# EAGLE design Searchlight Controller V3_4 (EAGLE 8.0.2)
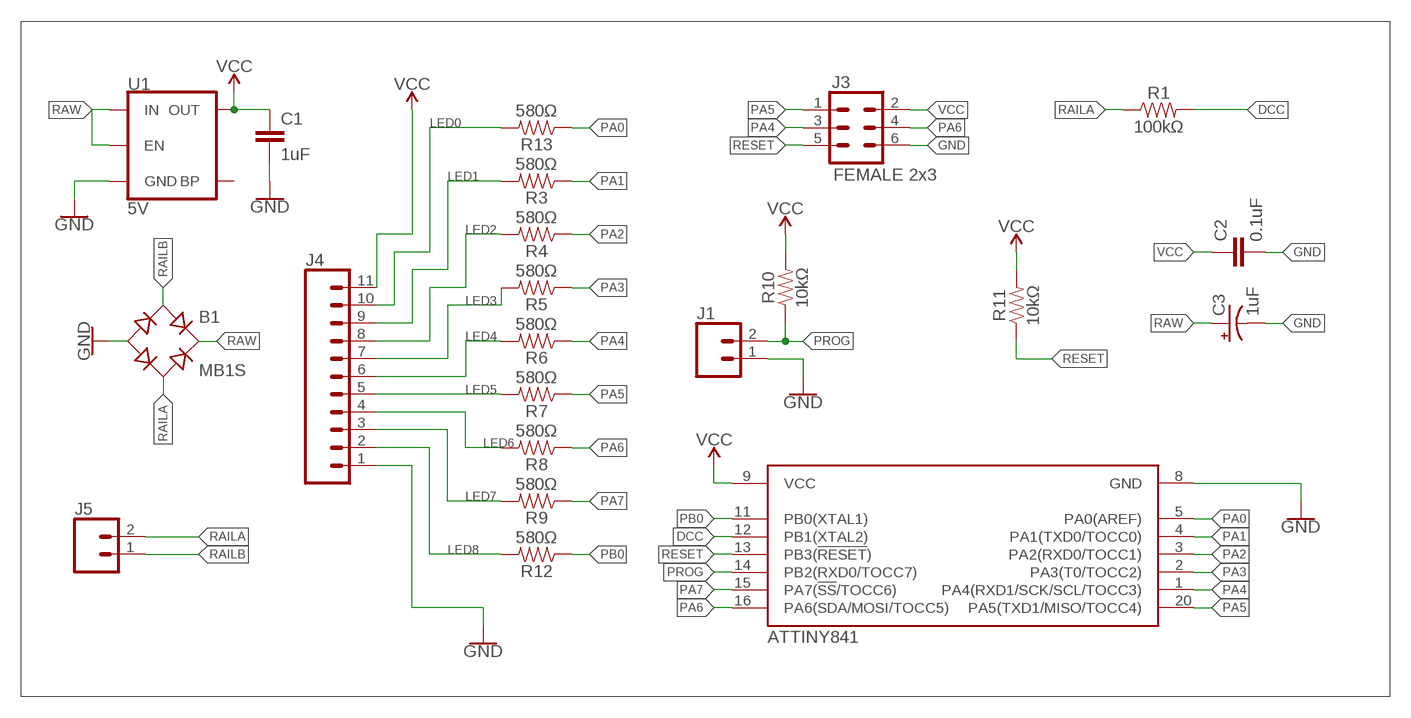
[diagram p0: schematic, sheet 1]

## Parts
B1  MB1S  [SOIC-4]
C1  1uF  0.1UF-0603-25V-5%  [0603]
C2  0.1uF  0.1UF-0603-25V-5%  [0603]
C3  1uF  10UF-POLAR-EIA3216-16V-10%(TANT)  [EIA3216]
J1  CONN_02LOCK  [1X02_LOCK]
J3  FEMALE 2x3  CONN_03X2FEMALE  [2X3]
J4  CONN_11LONGPADS  [1X11_LONGPADS]
J5  CONN_02  [1X02]
R1  100kΩ  RESISTOR0603  [0603]
R3  580Ω  RESISTOR0603  [0603]
R4  580Ω  RESISTOR0603  [0603]
R5  580Ω  RESISTOR0603  [0603]
R6  580Ω  RESISTOR0603  [0603]
R7  580Ω  RESISTOR0603  [0603]
R8  580Ω  RESISTOR0603  [0603]
R9  580Ω  RESISTOR0603  [0603]
R10  10kΩ  RESISTOR0603  [0603]
R11  10kΩ  RESISTOR0603  [0603]
R12  580Ω  RESISTOR0603  [0603]
R13  580Ω  RESISTOR0603  [0603]
U1  5V  V_REG_MIC52055V  [SOT23-5]
U$1  ATTINY841-MMH  [QFN-20-4X4MM]

## Nets
DCC: R1.2 U$1.12(PB1(XTAL2))
GND: B1.- C1.2 C2.2 C3.- J1.1 J3.6 J4.1 U1.2(GND) U$1.8(GND)
LED0: J4.10 R13.2
LED1: J4.9 R3.2
LED2: J4.8 R4.2
LED3: J4.7 R5.2
LED4: J4.6 R6.2
LED5: J4.5 R7.2
LED6: J4.4 R8.2
LED7: J4.3 R9.2
LED8: J4.2 R12.2
PA0: R13.1 U$1.5(PA0(AREF))
PA1: R3.1 U$1.4(PA1(TXD0/TOCC0))
PA2: R4.1 U$1.3(PA2(RXD0/TOCC1))
PA3: R5.1 U$1.2(PA3(T0/TOCC2))
PA4: J3.3 R6.1 U$1.1(PA4(RXD1/SCK/SCL/TOCC3))
PA5: J3.1 R7.1 U$1.20(PA5(TXD1/MISO/TOCC4))
PA6: J3.4 R8.1 U$1.16(PA6(SDA/MOSI/TOCC5))
PA7: R9.1 U$1.15(PA7(!SS!/TOCC6))
PB0: R12.1 U$1.11(PB0(XTAL1))
PROG: J1.2 R10.1 U$1.14(PB2(RXD0/TOCC7))
RAILA: B1.~2(AC2) J5.2 R1.1
RAILB: B1.~1(AC1) J5.1
RAW: B1.+ C3.+ U1.1(IN) U1.3(EN)
RESET: J3.5 R11.1 U$1.13(PB3(!RESET!))
VCC: C1.1 C2.1 J3.2 J4.11 R10.2 R11.2 U1.5(OUT) U$1.9(VCC)
Unconnected: U1.4(BP)

## Library data of the parts
B1 = rectifier:MB*S: Bridge Rectifier Source: http://www.fairchildsemi.com/ds/MB/MB6S.pdf
C1 = SparkFun-Capacitors:0.1UF: 0.1µF ceramic capacitors A capacitor is a passive two-terminal electrical component used to store electrical energy temporarily in an electric field.; PROD_ID: CAP-08604; VALUE: 0.1uF
C2 = SparkFun-Capacitors:0.1UF: 0.1µF ceramic capacitors A capacitor is a passive two-terminal electrical component used to store electrical energy temporarily in an electric field.; PROD_ID: CAP-08604
C3 = SparkFun-Capacitors:10UF-POLAR: 10.0µF polarized capacitors A capacitor is a passive two-terminal electrical component used to store electrical energy temporarily in an electric field.; PROD_ID: CAP-00811; VALUE: 10uF
J1 J5 = SparkFun-Connectors:CONN_02: Multi connection point. Often used as Generic Header-pin footprint for 0.1 inch spaced/style header connections On any of the 0.1 inch spaced packages, you can populate with these: Break Away Headers - Straight <https://www.sparkfun.com/products/116> (PRT-00116) Break Away Male Headers - Right Angle <https://www.sparkfun.com/products/553> (PRT-00553) Female Headers <https://www.sparkfun.com/products/115> (PRT-00115) Break Away Headers - Machine Pin <https://www.sparkfun.com/products/117> (PRT-00117) Break Away Female Headers - Swiss Machine Pin <https://www.sparkfun.com/products/743> (PRT-00743) For SCREWTERMINALS and SPRING TERMINALS visit here: Screw Terimnals on SparkFun.com <https://www.sparkfun.com/search/results?term=Screw+Terminals> (5mm/3.5mm/2.54mm spacing) This device is also useful as a general connection point to wire up your design to another part of your project. Our various solder wires solder well into these plated through hole pads. Hook-Up Wire - Assortment (Stranded, 22 AWG) <https://www.sparkfun.com/products/11375> (PRT-11375) Hook-Up Wire - Assortment (Solid Core, 22 AWG) <https://www.sparkfun.com/products/11367> (PRT-11367) View the entire wire category on our website here <https://www.sparkfun.com/categories/141> Special notes: Molex polarized connector foot print use with: PRT-08233 with associated crimp pins and housings. 2.54_SCREWTERM for use with PRT-10571. 3.5mm Screw Terminal footprints for PRT-08084 5mm Screw Terminal footprints for use with PRT-08432
J3 = SparkFun-Connectors:CONN_03X2: Multi connection point. Often used as Generic Header-pin footprint for 0.1 inch spaced/style header connections You can populate with any combo of single row headers, but if you'd like an exact match, check these: Header - 2x3 (Male, 0.1") <https://www.sparkfun.com/products/12807> (PRT-12807) Header - 2x3 (Female, 0.1") <https://www.sparkfun.com/products/13010> (PRT-13010) 2x3 Pin Shrouded Header <https://www.sparkfun.com/products/10877> (PRT-10877) On any of the 0.1 inch spaced packages, you can populate with these: Break Away Headers - Straight <https://www.sparkfun.com/products/116> (PRT-00116) Break Away Male Headers - Right Angle <https://www.sparkfun.com/products/553> (PRT-00553) Female Headers <https://www.sparkfun.com/products/115> (PRT-00115) Break Away Headers - Machine Pin <https://www.sparkfun.com/products/117> (PRT-00117) Break Away Female Headers - Swiss Machine Pin <https://www.sparkfun.com/products/743> (PRT-00743) Special note: the shrouded connector mates well with our 3x2 ribbon cables: Ribbon Crimp Connector - 6-pin (2x3, Female) <https://www.sparkfun.com/products/10651> (PRT-10651) Ribbon Cable - 6 wire (15ft) <https://www.sparkfun.com/products/10646> (PRT-10646); PROD_ID: CONN-11566
J4 = SparkFun-Connectors:CONN_11: Multi connection point. Often used as Generic Header-pin footprint for 0.1 inch spaced/style header connections On any of the 0.1 inch spaced packages, you can populate with these: Break Away Headers - Straight <https://www.sparkfun.com/products/116> (PRT-00116) Break Away Male Headers - Right Angle <https://www.sparkfun.com/products/553> (PRT-00553) Female Headers <https://www.sparkfun.com/products/115> (PRT-00115) Break Away Headers - Machine Pin <https://www.sparkfun.com/products/117> (PRT-00117) Break Away Female Headers - Swiss Machine Pin <https://www.sparkfun.com/products/743> (PRT-00743) For SCREWTERMINALS and SPRING TERMINALS visit here: Screw Terimnals on SparkFun.com <https://www.sparkfun.com/search/results?term=Screw+Terminals> (5mm/3.5mm/2.54mm spacing) This device is also useful as a general connection point to wire up your design to another part of your project. Our various solder wires solder well into these plated through hole pads. Hook-Up Wire - Assortment (Stranded, 22 AWG) <https://www.sparkfun.com/products/11375> (PRT-11375) Hook-Up Wire - Assortment (Solid Core, 22 AWG) <https://www.sparkfun.com/products/11367> (PRT-11367) View the entire wire category on our website here <https://www.sparkfun.com/categories/141>
R1 R3-R13 = SparkFun-Resistors:RESISTOR: Generic Resistor Package
U1 = SparkFun-IC-Power:V_REG_MIC5205: V_REG MIC5205 Standard 3.3V, 5V, and Adjustable 150mA LDO voltage regulator in SOT-23 layout. Micrel part MIC5205. BP (by-pass) pin is used to lower output noise with 470pF cap, may be left open. On the adjustable version BP is used to set output.; PROD_ID: VREG-00823
U$1 = CESM_Microcontrollers:ATTINY841-MMH

## Board
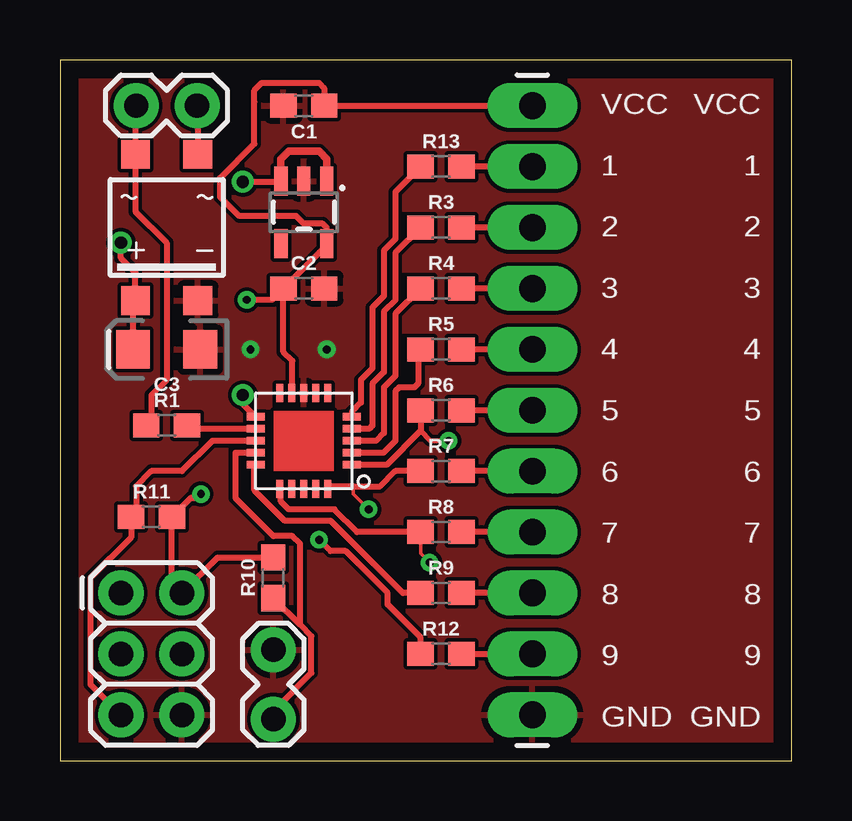
[diagram p1: board, top side]
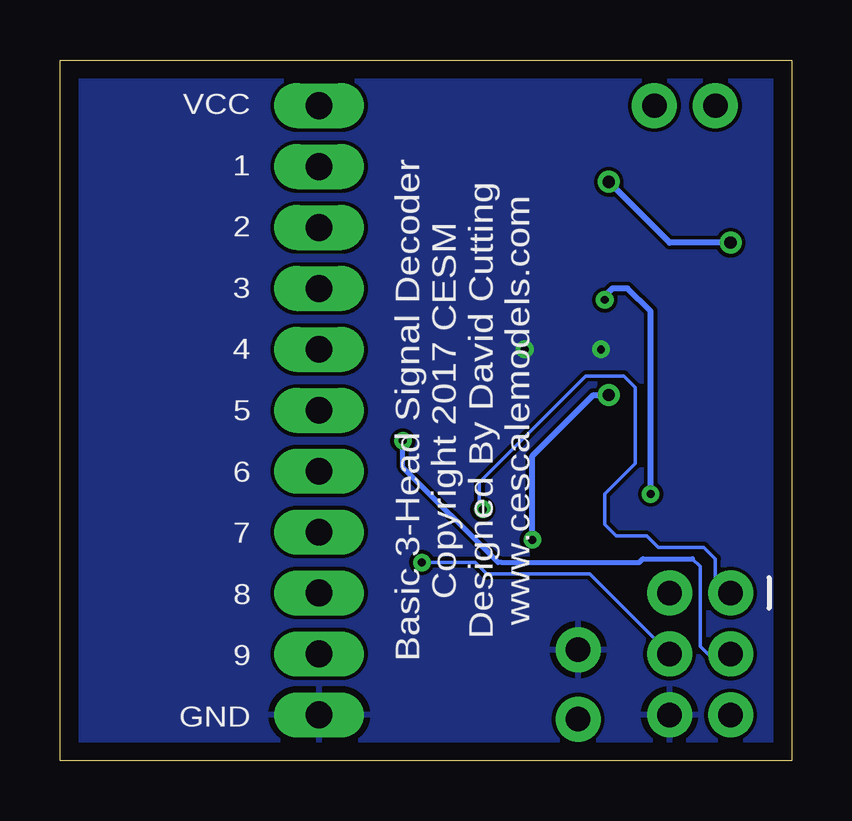
[diagram p2: board, bottom side, seen from below]

Size 30.48 x 29.21 mm. Coordinates in mm from the lower left corner, seen from the top.
Outline: 0,29.21 0,29.2
Outline: 0,29.21 0,0 30.48,0 30.48,29.21 0,29.21
Copper layers (1*16): Top 0.035mm / dielectric 1.5mm / Bottom 0.035mm
Design rules "default *": minimum track width 6mil, minimum drill 13mil, track to track 6mil, track to pad 6mil, pad to pad 6mil, via to via 6mil, smd to smd 6mil, copper to edge 30mil, drill to drill 8mil, minimum pad ring 10mil, minimum via ring 8mil, stop-mask expansion 4mil, vias tented up to drill 25mil, thermal gap 10mil

### Footprints (pad centres in the part's own frame; a part is rotated, then mirrored left to right if it is on the bottom)
SOIC-4 = smd 1.2 x 1.2: + 1.3,3.05; - -1.3,3.05; ~1 -1.3,-3.05; ~2 1.3,-3.05
0603 = smd 1.1 x 1: 1 -0.85,0; 2 0.85,0
EIA3216 = smd 1.4 x 1.6: + 1.4,0; - -1.4,0
1X02_LOCK = drill 1.016 pad 1.88: 1 -0.178,0; 2 2.718,0
2X3 = drill 1.016 pad 1.88: 1 0,0; 2 0,2.54; 3 2.54,0; 4 2.54,2.54; 5 5.08,0; 6 5.08,2.54
1X11_LONGPADS = drill 1.118 pad 1.88 long: 1 0,0; 2 2.54,0; 3 5.08,0; 4 7.62,0; 5 10.16,0; 6 12.7,0; 7 15.24,0; 8 17.78,0; 9 20.32,0; 10 22.86,0; 11 25.4,0
1X02 = drill 1.016 pad 1.88: 1 0,0; 2 2.54,0
SOT23-5 = smd 0.55 x 1.2: 1 -0.95,-1.3; 2 0,-1.3; 3 0.95,-1.3; 4 0.95,1.3; 5 -0.95,1.3
QFN-20-4X4MM = smd 0.75 x 0.3: 1 -2,1; 2 -2,0.5; 3 -2,0; 4 -2,-0.5; 5 -2,-1; 11 2,-1; 12 2,-0.5; 13 2,0; 14 2,0.5; 15 2,1 | smd 0.3 x 0.75: 6 -1,-2; 7 -0.5,-2; 8 0,-2; 9 0.5,-2; 10 1,-2; 16 1,2; 17 0.5,2; 18 0,2; 19 -0.5,2; 20 -1,2

### Placement (x,y rotation side)
B1  4.45,22.23 180 top
C1  10.16,27.3 180 top
C2  10.16,19.68 0 top
C3  4.45,17.14 180 top
J1  8.89,4.45 270 top
J3  2.54,6.99 270 top
J4  19.69,1.91 90 top
J5  5.71,27.3 180 top
R1  4.45,13.97 0 top
R3  15.88,22.23 0 top
R4  15.88,19.68 0 top
R5  15.88,17.14 0 top
R6  15.88,14.61 0 top
R7  15.88,12.06 0 top
R8  15.88,9.53 0 top
R9  15.88,6.99 0 top
R10  8.89,7.62 90 top
R11  3.81,10.16 0 top
R12  15.88,4.45 0 top
R13  15.88,24.77 0 top
U1  10.16,22.86 180 top
U$1  10.16,13.34 180 top

### Tracks (layer width: path | path; a pad name or v marks a point on that pad's centre or on a via)
DCC
  Top 0.254: U$1.12 5.43,13.84 R1.2
GND  (via drill 0.33 pad 0.69)
  other vias: 7.94,17.14 11.11,17.14
  pour Top: 0,0 30.48,0 30.48,29.21 0,29.21
  pour Bottom: 0,29.21 30.48,29.21 30.48,0 0,0
LED0
  Top 0.254: J4.10 R13.2
LED1
  Top 0.254: J4.9 R3.2
LED2
  Top 0.254: J4.8 R4.2
LED3
  Top 0.254: J4.7 R5.2
LED4
  Top 0.254: J4.6 R6.2
LED5
  Top 0.254: J4.5 R7.2
LED6
  Top 0.254: J4.4 R8.2
LED7
  Top 0.254: J4.3 R9.2
LED8
  Top 0.254: R12.2 J4.2
PA0
  Top 0.254: R13.1 13.97,23.71 13.97,21.75 13.49,21.27 13.49,19.37 13.02,18.89 13.02,16.35 12.54,15.88 12.54,14.92 12.16,14.54 U$1.5
PA1
  Top 0.254: R3.1 13.97,21.17 13.97,19.21 13.49,18.73 13.49,16.19 13.02,15.72 13.02,13.97 12.88,13.84 U$1.4
PA2
  Top 0.254: R4.1 13.97,18.63 13.97,16.03 13.49,15.56 13.49,13.65 13.18,13.34 U$1.3
PA3
  Top 0.254: R5.1 14.92,17.04 14.92,15.72 14.76,15.56 14.13,15.56 13.97,15.4 13.97,13.34 13.47,12.84 U$1.2
PA4  (via drill 0.33 pad 0.69)
  Top 0.203: 15.03,13.76 15.45,13.34 v16.19,13.34
  Top 0.254: U$1.1 13.61,12.34 15.03,13.76 R6.1
  Bottom 0.152: 4.13,8.41 3.81,8.1 3.81,4.76 3.49,4.45 J3.3
  Bottom 0.203: 12.06,8.26 12.22,8.26 | 12.06,8.26 6.35,8.26 6.19,8.41 4.13,8.41 | 12.06,8.26 12.22,8.26 | 12.22,8.26 16.19,12.22 v16.19,13.34
PA5  (via drill 0.33 pad 0.69)
  Top 0.152: v12.86,10.48 12.22,11.11 12.22,11.43
  Top 0.254: R7.1 13.97,12.06 13.33,11.43 12.22,11.43 11.25,11.43 U$1.20
  Bottom 0.152: J3.1 3.17,7.62 3.17,8.41 3.65,8.89 5.56,8.89 6.03,9.37 7.3,9.37 7.78,9.84 7.78,11.11 6.51,12.38 6.51,15.56 6.98,16.03 8.57,16.03 13.02,11.59 13.02,10.48 v12.86,10.48
PA6  (via drill 0.33 pad 0.69)
  Top 0.152: v15.4,8.26 15.03,8.63 R8.1
  Top 0.254: R8.1 12.38,9.53 11.43,10.48 9.53,10.48 9.21,10.79 9.21,11.29 U$1.16
  Bottom 0.152: J3.4 8.41,7.78 12.7,7.78 13.18,8.26 v15.4,8.26
PA7
  Top 0.254: R9.1 14.29,6.99 11.27,10 9.37,10 8.1,11.27 8.1,12.27 U$1.15
PB0  (via drill 0.33 pad 0.69, 0.51)
  Top 0.254: R12.1 15.03,5.14 13.65,6.51 13.65,6.99 11.91,8.73 11.27,8.73 v10.79,9.21 | v7.62,15.24 7.62,14.88 U$1.11
  Bottom 0.254: v10.79,9.21 10.79,12.7 8.26,15.24 v7.62,15.24
PROG
  Top 0.254: J1.2 8.89,2.06 10.48,3.65 10.48,5.18 10,5.66 | R10.1 10,5.66 | 10,5.66 10,9.05 9.68,9.37 8.89,9.37 7.3,10.95 7.3,12.84 U$1.14 7.75,12.84
RAILA
  Top 0.254: J5.2 3.14,27.3 B1.~2 3.14,22.89 4.45,21.59 4.45,15.88 3.81,15.24 3.81,14.19 R1.1
RAILB
  Top 0.254: J5.1 5.75,27.3 B1.~1
RAW  (via drill 0.51)
  Top 0.254: C3.+ 3.04,19.07 B1.+ 3.14,20.35 2.54,20.95 v2.54,21.59 | v7.62,24.13 9.18,24.13 U1.3
  Top 0.305: U1.3 9.21,25.08 9.53,25.4 10.79,25.4 11.11,25.08 U1.1
  Bottom 0.254: v2.54,21.59 5.08,21.59 v7.62,24.13
RESET
  Top 0.254: U$1.13 6.35,13.34 5.08,12.06 3.81,12.06 3.17,11.43 3.17,10.38 R11.1 2.96,9.31 1.27,7.62 1.27,3.17 J3.5
VCC  (via drill 0.33 pad 0.69)
  Top 0.254: J4.11 C1.1 11.01,28.04 10.79,28.26 8.41,28.26 8.1,27.94 8.1,27.46 8.1,25.72 6.67,24.29 6.67,23.5 7.46,22.7 8.57,22.7 9.84,22.7 10.16,22.38 10.95,22.38 11.11,22.23 U1.5 11.11,21.48 C2.1 | U$1.9 9.68,15.36 9.68,16.67 9.31,17.04 C2.1 | R10.2 6.56,8.47 J3.2 4.66,7.41 R11.2 5.45,10.95 5.87,10.95 v5.87,11.11 | C2.1 8.83,19.21 v7.78,19.21
  Bottom 0.254: v5.87,11.11 5.87,18.73 6.83,19.68 7.46,19.68 7.78,19.37 v7.78,19.21

### Text on the board
tNames: VCC / / 1 / / 2 / / 3 / / 4 / / 5 / / 6 / / 7 / / 8 / / 9 / / GND | VCC / / 1 / / 2 / / 3 / / 4 / / 5 / / 6 / / 7 / / 8 / / 9 / / GND
bNames: Basic 3-Head Signal Decoder / Copyright 2017 CESM / Designed By David Cutting / www.cescalemodels.com | VCC / / 1 / / 2 / / 3 / / 4 / / 5 / / 6 / / 7 / / 8 / / 9 / / GND